# EAGLE schematic bc-module-sigfox-r2 (EAGLE 7.7.0)
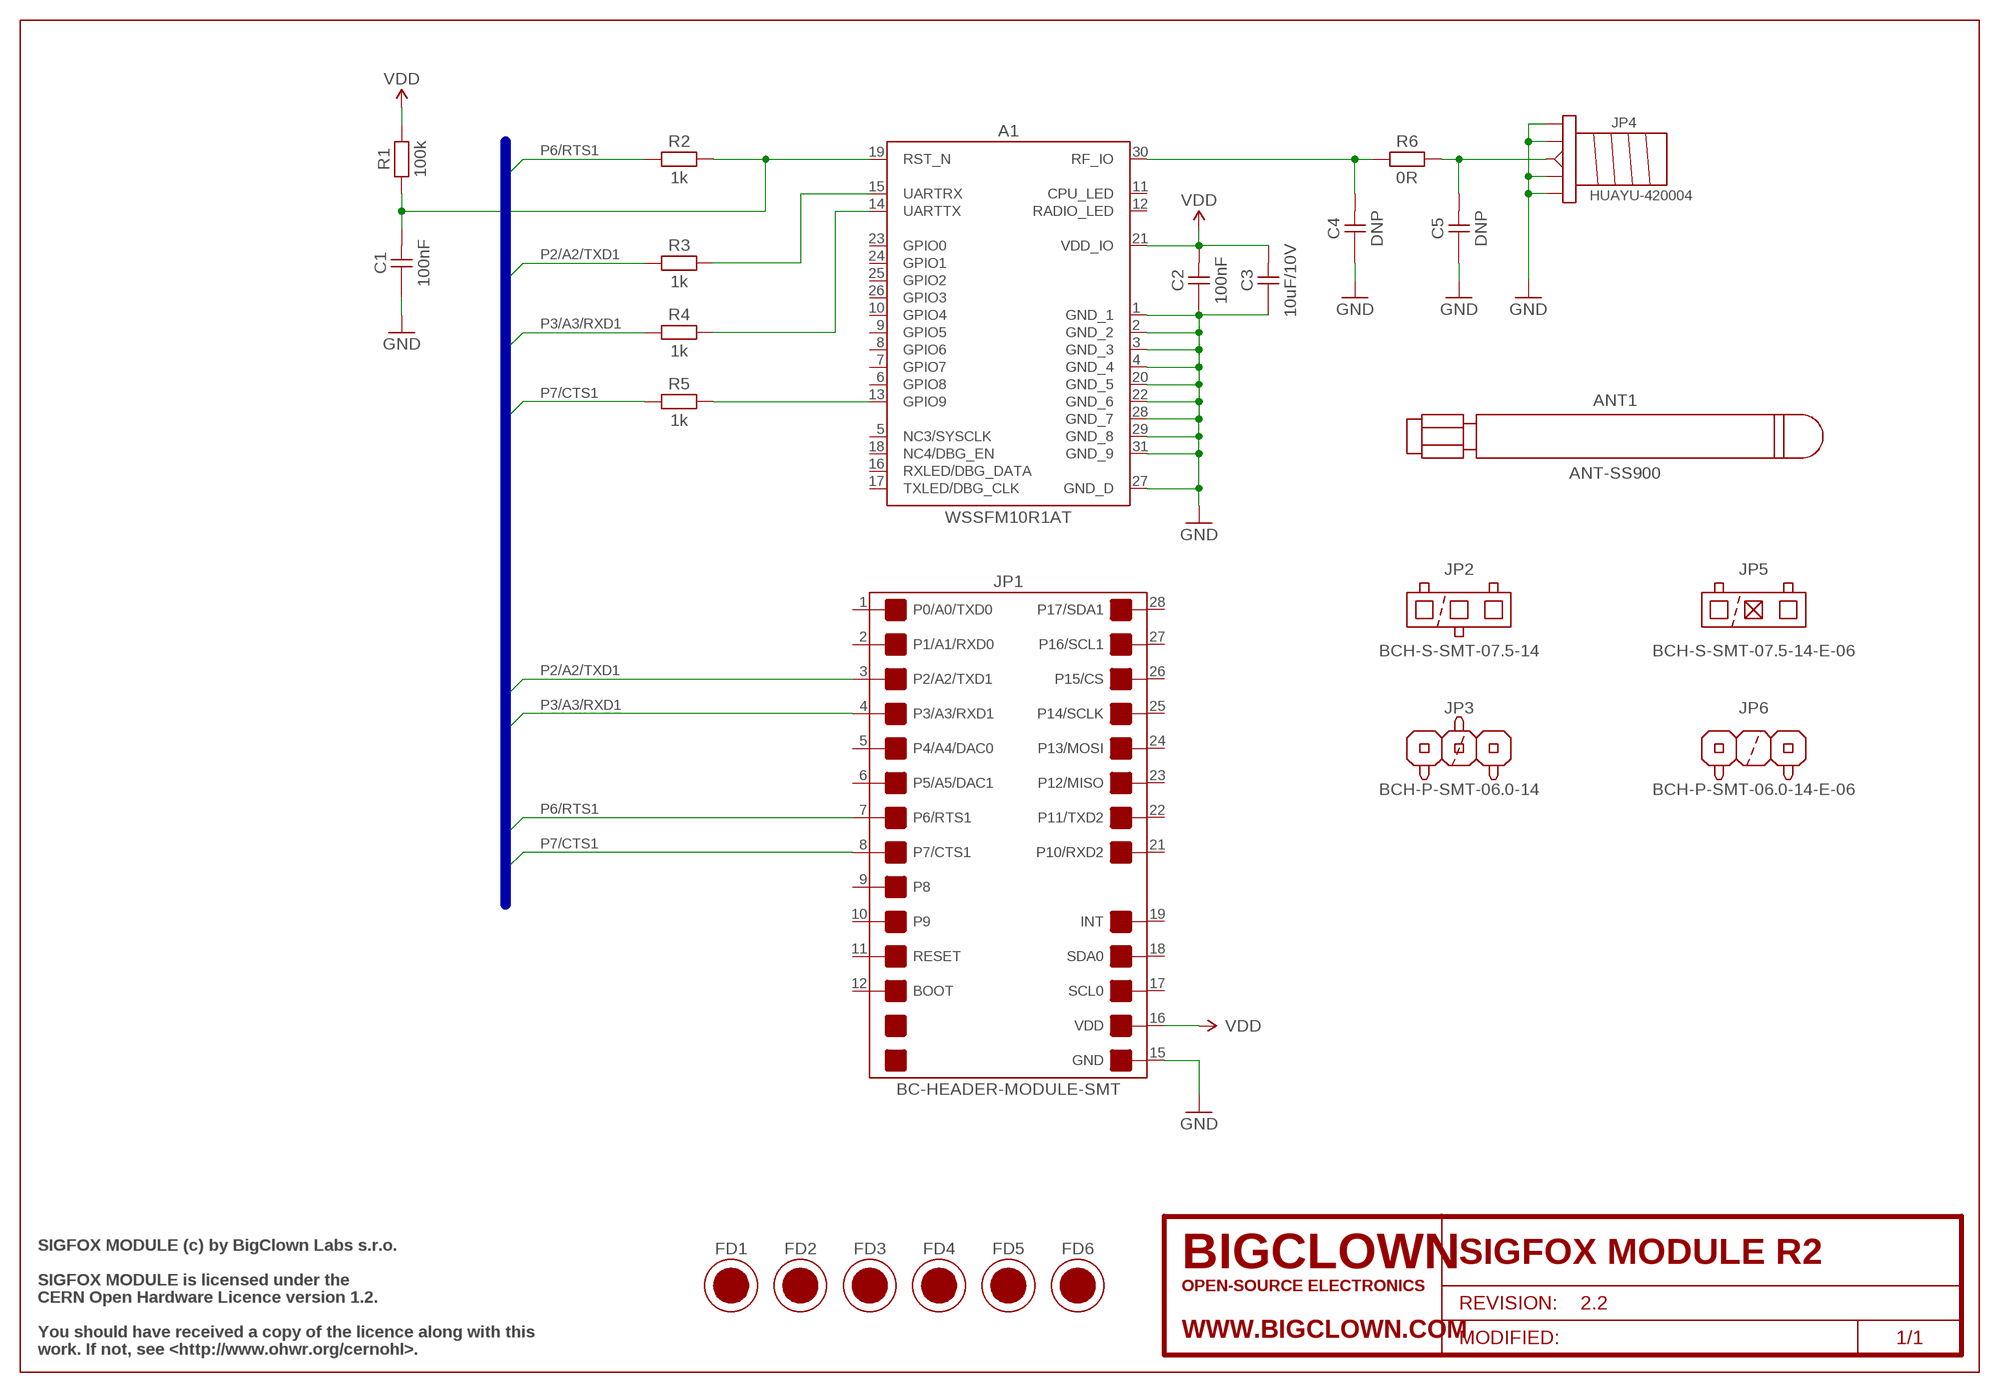
[diagram p0: schematic, sheet 1]
ANT1 (AN-ANT-SS900): BCPN: BC-AN-ANT-SS900; VALUE: ANT-SS900

## Parts
A1  WSSFM10R1AT  A-WSSFM10R1AT  [WSSFM10R1AT_R]
C1  100nF  C-0603-100NF  [CAPACITOR-0603_R]
C2  100nF  C-0603-100NF  [CAPACITOR-0603_R]
C3  10uF/10V  C-0603-10UF-10V  [CAPACITOR-0603_R]
C4  DNP  C-0603-DNP  [CAPACITOR-0603_R]
C5  DNP  C-0603-DNP  [CAPACITOR-0603_R]
FD1  FIDUCIAL  [FIDUCIAL-1MM]
FD2  FIDUCIAL  [FIDUCIAL-1MM]
FD3  FIDUCIAL  [FIDUCIAL-1MM]
FD4  FIDUCIAL  [FIDUCIAL-1MM]
FD5  FIDUCIAL  [FIDUCIAL-1MM]
FD6  FIDUCIAL  [FIDUCIAL-1MM]
FRAME1  FRAME-SCH/A4L-BRD/A4L  [FRAME-A4L]
JP1  BC-HEADER-MODULE-SMT  [BC-HEADER-MODULE-SMT]
JP2  BCH-S-SMT-07.5-14  JP-BCH-S-SMT-07.5-14  [BCH-S-SMT-14]
JP3  BCH-P-SMT-06.0-14  JP-BCH-P-SMT-06.0-14  [BCH-P-SMT-14]
JP4  HUAYU-420004  JP-420004  [HUAYU-420004]
JP5  BCH-S-SMT-07.5-14-E-06  JP-BCH-S-SMT-07.5-14-E-06  [BCH-S-SMT-14-E-06]
JP6  BCH-P-SMT-06.0-14-E-06  JP-BCH-P-SMT-06.0-14-E-06  [BCH-P-SMT-14-E-06]
R1  100k  R-0603-100K  [RESISTOR-0603_R]
R2  1k  R-0603-1K  [RESISTOR-0603_R]
R3  1k  R-0603-1K  [RESISTOR-0603_R]
R4  1k  R-0603-1K  [RESISTOR-0603_R]
R5  1k  R-0603-1K  [RESISTOR-0603_R]
R6  0R  R-0603-0R  [RESISTOR-0603_R]

## Nets
ANT: C5.1 JP4.0 R6.2
GND: A1.1(GND_1) A1.2(GND_2) A1.3(GND_3) A1.4(GND_4) A1.20(GND_5) A1.22(GND_6) A1.27(GND_D) A1.28(GND_7) A1.29(GND_8) A1.31(GND_9) C1.2 C2.2 C3.2 C4.2 C5.2 JP1.15(GND) JP4.1 JP4.2 JP4.3 JP4.4
GPIO9: A1.13(GPIO9) R5.2
P2/A2/TXD1: JP1.3(P2/A2/TXD1) R3.1
P3/A3/RXD1: JP1.4(P3/A3/RXD1) R4.1
P6/RTS1: JP1.7(P6/RTS1) R2.1
P7/CTS1: JP1.8(P7/CTS1) R5.1
RF_IO: A1.30(RF_IO) C4.1 R6.1
RST_N: A1.19(RST_N) C1.1 R1.1 R2.2
UARTRX: A1.15(UARTRX) R3.2
UARTTX: A1.14(UARTTX) R4.2
VDD: A1.21(VDD_IO) C2.1 C3.1 JP1.16(VDD) R1.2
Unconnected: A1.5(NC3/SYSCLK) A1.6(GPIO8) A1.7(GPIO7) A1.8(GPIO6) A1.9(GPIO5) A1.10(GPIO4) A1.11(CPU_LED) A1.12(RADIO_LED) A1.16(RXLED/DBG_DATA) A1.17(TXLED/DBG_CLK) A1.18(NC4/DBG_EN) A1.23(GPIO0) A1.24(GPIO1) A1.25(GPIO2) A1.26(GPIO3) JP1.1(P0/A0/TXD0) JP1.2(P1/A1/RXD0) JP1.5(P4/A4/DAC0) JP1.6(P5/A5/DAC1) JP1.9(P8) JP1.10(P9) JP1.11(RESET) JP1.12(BOOT) JP1.17(SCL0) JP1.18(SDA0) JP1.19(INT) JP1.21(P10/RXD2) JP1.22(P11/TXD2) JP1.23(P12/MISO) JP1.24(P13/MOSI) JP1.25(P14/SCLK) JP1.26(P15/CS) JP1.27(P16/SCL1) JP1.28(P17/SDA1)

## Buses
P2/A2/TXD1,P3/A3/RXD1,P6/RTS1,P7/CTS1

## Notes on the sheet
- SIGFOX MODULE (c) by BigClown Labs s.r.o.
- SIGFOX MODULE is licensed under the
- CERN Open Hardware Licence version 1.2.
- You should have received a copy of the licence along with this
- work. If not, see <http://www.ohwr.org/cernohl>.

## Library data of the parts
A1 = bc-radio:A-WSSFM10R1AT; BCPN: BC-A-WSSFM10R1AT
C1 C2 = bc-capacitor:C-0603-100NF; BCPN: BC-C-0603-100NF
C3 = bc-capacitor:C-0603-10UF-10V; BCPN: BC-C-0603-10UF-10V
C4 C5 = bc-capacitor:C-0603-DNP; BCPN: -
FD1-FD6 = bc-fiducial:FIDUCIAL; BCPN: -
FRAME1 = bc-frame:FRAME-SCH/A4L-BRD/A4L; BCPN: -; PROJECT_NAME: SIGFOX MODULE R2; PROJECT_REVISION: 2.2
JP1 = bc-header:BC-HEADER-MODULE-SMT; BCPN: -
JP2 = bc-header:JP-BCH-S-SMT-07.5-14; BCPN: BC-JP-BCH-S-SMT-07.5-14
JP3 = bc-header:JP-BCH-P-SMT-06.0-14; BCPN: BC-JP-BCH-P-SMT-06.0-14
JP4 = bc-connector:JP-420004; BCPN: BC-JP-HUAYU-420004
JP5 = bc-header:JP-BCH-S-SMT-07.5-14-E-06; BCPN: BC-JP-BCH-S-SMT-07.5-14-E-06
JP6 = bc-header:JP-BCH-P-SMT-06.0-14-E-06; BCPN: BC-JP-BCH-P-SMT-06.0-14-E-06
R1 = bc-resistor:R-0603-100K; BCPN: BC-R-0603-100k
R2-R5 = bc-resistor:R-0603-1K; BCPN: BC-R-0603-1k
R6 = bc-resistor:R-0603-0R; BCPN: BC-R-0603-0R